# Altium project EEG_Electrodes.PrjPcb
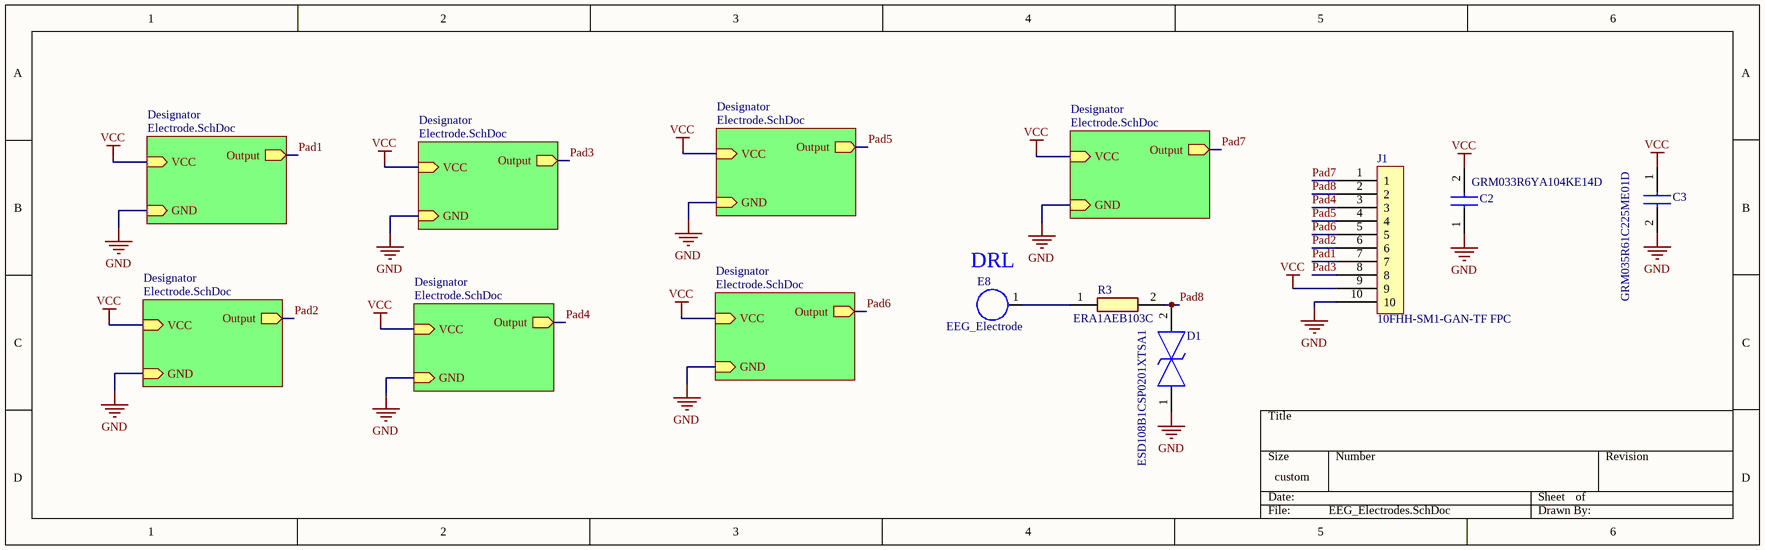
[diagram p0: EEG_Electrodes.SchDoc]
2 sheets, 62 parts. Net scope: hierarchical (ports join the sheet entries above them; power ports are global).
Board files: EEG_Electrodes.PcbDoc, EEG_Electrodesv2.PcbDoc
Sheets:
  EEG_Electrodes.SchDoc
    Designator = Electrode.SchDoc
    Designator = Electrode.SchDoc
    Designator = Electrode.SchDoc
    Designator = Electrode.SchDoc
    Designator = Electrode.SchDoc
    Designator = Electrode.SchDoc
    Designator = Electrode.SchDoc

## Sheet EEG_Electrodes.SchDoc
size 330 x 101 mm; SheetNumber: 1; SheetTotal: 2

### Parts
C2  GRM033R6YA104KE14D  [CAPC0603X33N]
C3  GRM035R61C225ME01D  [GRM033D70J224ME01D]
D1  ESD108B1CSP0201XTSA1  [ESD108B1CSP0201XTSA1]
E8  EEG_Electrode  [EEG_Electrode]
J1  10FHH-SM1-GAN-TF FPC  [10FHH-SM1-GAN-TF FPC]
R3  ERA1AEB103C  [ERA1A_(0201)]

### Sub-sheets
Designator = Electrode.SchDoc: Output (out), GND (in), VCC (in)
Designator = Electrode.SchDoc: Output (out), GND (in), VCC (in)
Designator = Electrode.SchDoc: Output (out), GND (in), VCC (in)
Designator = Electrode.SchDoc: Output (out), GND (in), VCC (in)
Designator = Electrode.SchDoc: Output (out), GND (in), VCC (in)
Designator = Electrode.SchDoc: Output (out), GND (in), VCC (in)
Designator = Electrode.SchDoc: Output (out), GND (in), VCC (in)

### Nets
GND: C2.1 C3.2 D1.1 J1.10 ; sheet Designator/GND, sheet Designator/GND, sheet Designator/GND, sheet Designator/GND, sheet Designator/GND, sheet Designator/GND, sheet Designator/GND
VCC: C2.2 C3.1 J1.9 ; sheet Designator/VCC, sheet Designator/VCC, sheet Designator/VCC, sheet Designator/VCC, sheet Designator/VCC, sheet Designator/VCC, sheet Designator/VCC
Pad1: J1.7 ; sheet Designator/Output  [project net OUT]
Pad2: J1.6 ; sheet Designator/Output  [project net OUT]
Pad3: J1.8 ; sheet Designator/Output  [project net OUT]
Pad4: J1.3 ; sheet Designator/Output  [project net OUT]
Pad5: J1.4 ; sheet Designator/Output  [project net OUT]
Pad6: J1.5 ; sheet Designator/Output  [project net OUT]
Pad7: J1.1 ; sheet Designator/Output  [project net OUT]
Pad8: D1.2 J1.2 R3.2
NetE8_1: E8.1 R3.1

### Notes on the sheet
- (near E8) DRL

### Library data of the parts
C2 = GRM033R6YA104KE14D: Capacitor 0.1uF 0201; Manufacturer_Name: Murata Electronics; Datasheet Link: https://search.murata.co.jp/Ceramy/image/img/A01X/G101/ENG/GRM033R6YA104KE14-01A.pdf; Height: 0.33mm; Manufacturer_Part_Number: GRM033R6YA104KE14D; Mouser Part Number: 81-GRM33R6YA104KE14D; Mouser Price/Stock: https://www.mouser.co.uk/ProductDetail/Murata-Electronics/GRM033R6YA104KE14D?qs=P%2FC4Eoq9CDwTt3wOuyKhXw%3D%3D; Arrow Part Number: GRM033R6YA104KE14D; Arrow Price/Stock: https://www.arrow.com/en/products/grm033r6ya104ke14d/murata-manufacturing?utm_currency=USD&region=europe
C3 = GRM035R61C225ME01D: Capacitor 2.2uF 0201; Manufacturer_Name: Murata Electronics; Datasheet Link: https://search.murata.co.jp/Ceramy/image/img/A01X/G101/ENG/GRM035R61C225ME01-01A.pdf; Height: 0.33mm; Manufacturer_Part_Number: GRM035R61C225ME01D; Mouser Part Number: 81-GRM035R61C225ME1D; Mouser Price/Stock: https://www.mouser.co.uk/ProductDetail/Murata-Electronics/GRM035R61C225ME01D?qs=DPoM0jnrROXTliYh3Jmu1A%3D%3D
D1 = ESD108B1CSP0201XTSA1: TVS Diode (Bi-directional); Manufacturer_Name: Infineon; Datasheet Link: https://www.infineon.com/dgdl/Infineon-ESD108-B1-CSP0201-DS-v01_00-EN.pdf?fileId=5546d4624b0b249c014b1746e4d05aa8; Height: 0.16mm; Manufacturer_Part_Number: ESD108B1CSP0201XTSA1; Mouser Part Number: 726-ESD108B1CSP0201X; Mouser Price/Stock: https://www.mouser.co.uk/ProductDetail/Infineon-Technologies/ESD108B1CSP0201XTSA1?qs=3Bi3m9r5MQZFyNTZtNMRAQ%3D%3D; Arrow Part Number: ESD108B1CSP0201XTSA1; Arrow Price/Stock: https://www.arrow.com/en/products/esd108b1csp0201xtsa1/infineon-technologies-ag?region=nac
R3 = ERA1AEB103C: Resistor 10k; Manufacturer_Name: Panasonic; Datasheet Link: http://industrial.panasonic.com/cdbs/www-data/pdf/RDM0000/AOA0000C307.pdf; Height: 0.26mm; Manufacturer_Part_Number: ERA1AEB103C

## Sheet Electrode.SchDoc
size 177 x 109 mm; Author: Rishabh Jain; DrawnBy: Rishabh Jain; Revision: 1.0; SheetNumber: 2; SheetTotal: 2
Used 7 times, as channels Designator, Designator, Designator, Designator, Designator, Designator, Designator. Parts and nets are listed once, with the designators drawn on the sheet.
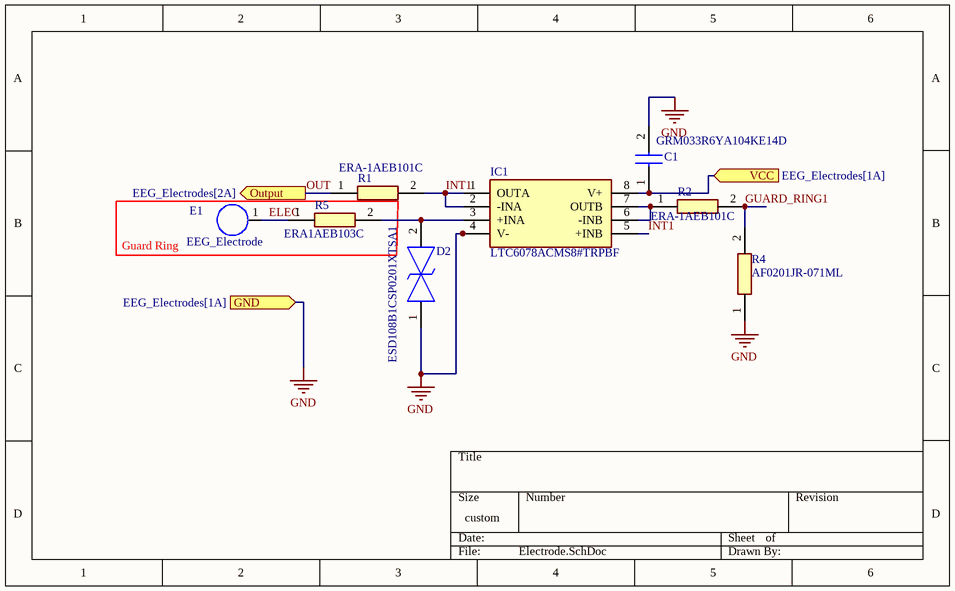
[diagram p1: Electrode.SchDoc]

### Parts
C1  GRM033R6YA104KE14D  [CAPC0603X33N]
D2  ESD108B1CSP0201XTSA1  [ESD108B1CSP0201XTSA1]
E1  EEG_Electrode  [EEG_Electrode]
IC1  LTC6078ACMS8#TRPBF  [SOP65P490X110-8N]
R1  ERA-1AEB101C  [ERA1A_(0201)]
R2  ERA-1AEB101C  [ERA1A_(0201)]
R4  AF0201JR-071ML  [ERA1A_(0201)]
R5  ERA1AEB103C  [ERA1A_(0201)]

### Blocks framed on the sheet
Guard Ring: E1 R5

### Ports
GND (in, see EEG_Electrodes[1A]), Output (out, see EEG_Electrodes[2A]), VCC (in, see EEG_Electrodes[1A])

### Nets
GND: C1.2 D2.1 IC1.4(V-) R4.1 ; port GND
ELEC: E1.1 R5.1
GUARD_RING1: R2.2 R4.2
INT1: IC1.1(OUTA) IC1.2(-INA) IC1.5(+INB) R1.2
OUT: R1.1 ; port Output
VCC: C1.1 IC1.8(V+) ; port VCC
NetD2_2: D2.2 IC1.3(+INA) R5.2
NetIC1_6: IC1.6(-INB) IC1.7(OUTB) R2.1

### Channels
Designator: designators end in G; ports GND=GND Output=OUT VCC=VCC
Designator: designators end in F; ports GND=GND Output=OUT VCC=VCC
Designator: designators end in E; ports GND=GND Output=OUT VCC=VCC
Designator: designators end in D; ports GND=GND Output=OUT VCC=VCC
Designator: designators end in C; ports GND=GND Output=OUT VCC=VCC
Designator: designators end in B; ports GND=GND Output=OUT VCC=VCC
Designator: designators end in A; ports GND=GND Output=OUT VCC=VCC

### Library data of the parts
C1 = GRM033R6YA104KE14D: as C2 on sheet EEG_Electrodes; Datasheet Link: https://search.murata.co.jp/Ceramy/image/img/A01X/G101/ENG/GRM033R6YA104KE14-01A.pdf; Height: 0.33mm; Manufacturer_Part_Number: GRM033R6YA104KE14D; Mouser Part Number: 81-GRM33R6YA104KE14D; Mouser Price/Stock: https://www.mouser.co.uk/ProductDetail/Murata-Electronics/GRM033R6YA104KE14D?qs=P%2FC4Eoq9CDwTt3wOuyKhXw%3D%3D; Arrow Part Number: GRM033R6YA104KE14D; Arrow Price/Stock: https://www.arrow.com/en/products/grm033r6ya104ke14d/murata-manufacturing?utm_currency=USD&region=europe
D2 = ESD108B1CSP0201XTSA1: as D1 on sheet EEG_Electrodes; Datasheet Link: https://www.infineon.com/dgdl/Infineon-ESD108-B1-CSP0201-DS-v01_00-EN.pdf?fileId=5546d4624b0b249c014b1746e4d05aa8; Height: 0.16mm; Manufacturer_Part_Number: ESD108B1CSP0201XTSA1; Mouser Part Number: 726-ESD108B1CSP0201X; Mouser Price/Stock: https://www.mouser.co.uk/ProductDetail/Infineon-Technologies/ESD108B1CSP0201XTSA1?qs=3Bi3m9r5MQZFyNTZtNMRAQ%3D%3D; Arrow Part Number: ESD108B1CSP0201XTSA1; Arrow Price/Stock: https://www.arrow.com/en/products/esd108b1csp0201xtsa1/infineon-technologies-ag?region=nac
IC1 = LTC6078ACMS8#TRPBF: Integrated Circuit; Manufacturer_Name: Analog Devices; Datasheet Link: https://datasheet.datasheetarchive.com/originals/distributors/Datasheets_SAMA/f60955edb7006695a84935bb44c6cde2.pdf; Height: 1.1mm; Manufacturer_Part_Number: LTC6078ACMS8#TRPBF; Mouser Part Number: 584-C6078ACMS8TRPBF; Mouser Price/Stock: https://www.mouser.com/Search/Refine.aspx?Keyword=584-C6078ACMS8TRPBF; Arrow Part Number: LTC6078ACMS8#TRPBF; Arrow Price/Stock: https://www.arrow.com/en/products/ltc6078acms8trpbf/analog-devices?region=nac
R1 R2 = ERA-1AEB101C: Resistor 100 ohms; Manufacturer_Name: Panasonic; Datasheet Link: http://industrial.panasonic.com/cdbs/www-data/pdf/RDM0000/AOA0000C307.pdf; Height: 0.26mm; Manufacturer_Part_Number: ERA-1AEB101C; Mouser Part Number: 667-ERA-1AEB101C; Mouser Price/Stock: https://www.mouser.co.uk/ProductDetail/Panasonic/ERA-1AEB101C?qs=6%252Bc%252B2ke79U4NC8Nf%252Bq1i6A%3D%3D; Arrow Part Number: ERA-1AEB101C; Arrow Price/Stock: https://www.arrow.com/en/products/era-1aeb101c/panasonic?region=nac
R4 = ERA-1AEB101C: Resistor 1M; Manufacturer_Name: Panasonic; Datasheet Link: http://industrial.panasonic.com/cdbs/www-data/pdf/RDM0000/AOA0000C307.pdf; Height: 0.26mm; Manufacturer_Part_Number: ERA-1AEB101C; Mouser Part Number: 667-ERA-1AEB101C; Mouser Price/Stock: https://www.mouser.co.uk/ProductDetail/Panasonic/ERA-1AEB101C?qs=6%252Bc%252B2ke79U4NC8Nf%252Bq1i6A%3D%3D; Arrow Part Number: ERA-1AEB101C; Arrow Price/Stock: https://www.arrow.com/en/products/era-1aeb101c/panasonic?region=nac
R5 = ERA1AEB103C: as R3 on sheet EEG_Electrodes; Datasheet Link: http://industrial.panasonic.com/cdbs/www-data/pdf/RDM0000/AOA0000C307.pdf; Height: 0.26mm; Manufacturer_Part_Number: ERA1AEB103C

## Nets that join several sheets
GND: EEG_Electrodes (C2.1 C3.2 D1.1 J1.10), Designator (C1G.2 D2G.1 IC1G.4 R4G.1), Designator (C1F.2 D2F.1 IC1F.4 R4F.1), Designator (C1E.2 D2E.1 IC1E.4 R4E.1), Designator (C1D.2 D2D.1 IC1D.4 R4D.1), Designator (C1C.2 D2C.1 IC1C.4 R4C.1), Designator (C1B.2 D2B.1 IC1B.4 R4B.1), Designator (C1A.2 D2A.1 IC1A.4 R4A.1)
VCC: EEG_Electrodes (C2.2 C3.1 J1.9), Designator (C1G.1 IC1G.8), Designator (C1F.1 IC1F.8), Designator (C1E.1 IC1E.8), Designator (C1D.1 IC1D.8), Designator (C1C.1 IC1C.8), Designator (C1B.1 IC1B.8), Designator (C1A.1 IC1A.8)
OUT: EEG_Electrodes (J1.1), Designator (R1A.1)
OUT: EEG_Electrodes (J1.3), Designator (R1D.1)
OUT: EEG_Electrodes (J1.4), Designator (R1C.1)
OUT: EEG_Electrodes (J1.5), Designator (R1B.1)
OUT: EEG_Electrodes (J1.6), Designator (R1F.1)
OUT: EEG_Electrodes (J1.7), Designator (R1G.1)
OUT: EEG_Electrodes (J1.8), Designator (R1E.1)